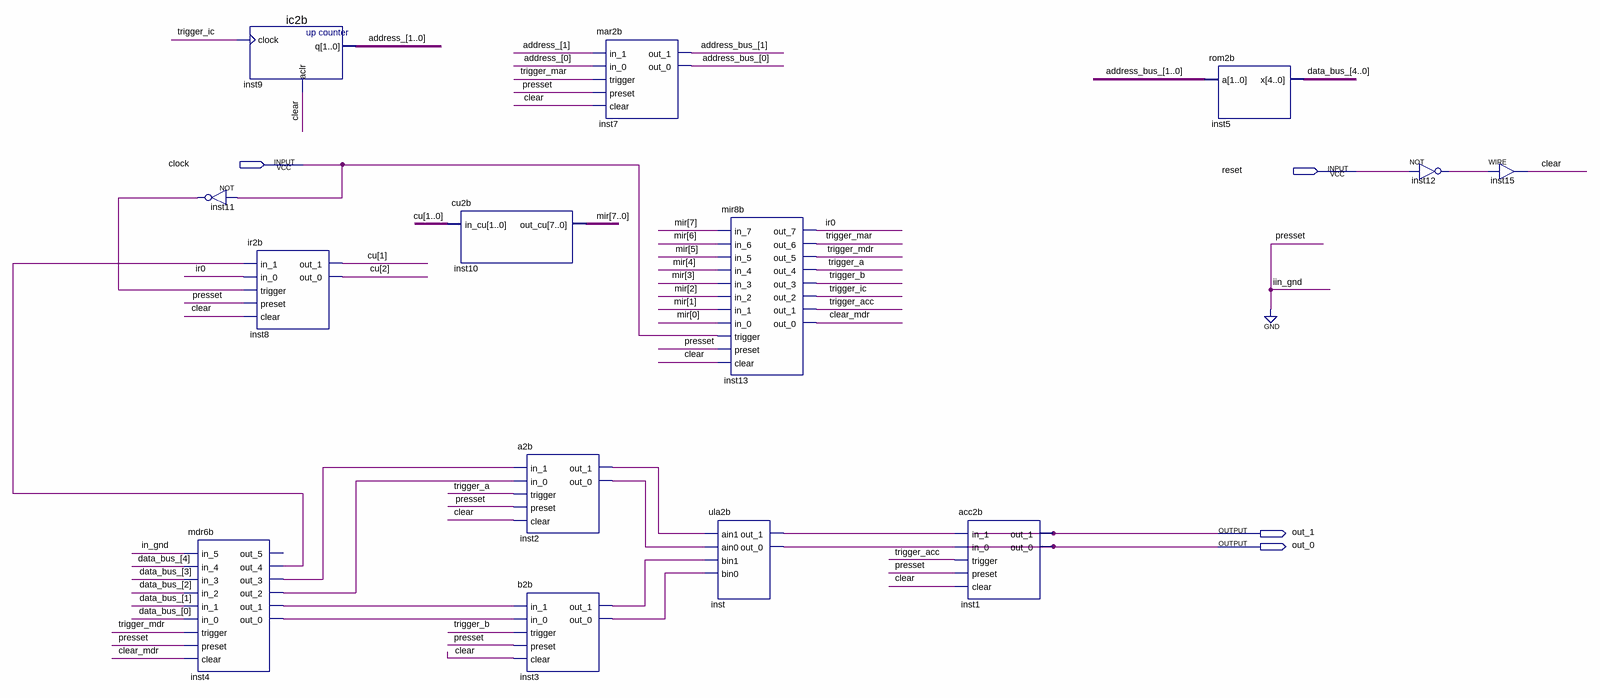
[diagram p0: schematic sheet]
// Quartus schematic FCTarc02.bdf as structural Verilog: 14 symbols, 4 pins
module FCTarc02 (
  input  clock,
  input  reset,
  output out_1,
  output out_0
);

  wire clear, clear_mdr, in_gnd, inst2_out_0, inst2_out_1, inst3_out_0, inst3_out_1, inst4_out_0,
       inst4_out_1, inst4_out_2, inst4_out_3, inst4_out_4, inst11_out, inst12_out, inst_out_0, inst_out_1,
       ir0, trigger_a, trigger_acc, trigger_b, trigger_ic, trigger_mar, trigger_mdr;
  wire [1:0] address_, address_bus_;
  wire [2:0] cu;
  wire [4:0] data_bus_;
  wire [7:0] mir;

  not inst11 (inst11_out, clock);
  mdr6b inst4 (
    .in_5(in_gnd), .in_4(data_bus_[4]), .in_3(data_bus_[3]), .in_2(data_bus_[2]), .in_1(data_bus_[1]),
    .in_0(data_bus_[0]), .trigger(trigger_mdr), .preset(1'b0), .clear(clear_mdr), .out_4(inst4_out_4),
    .out_3(inst4_out_3), .out_2(inst4_out_2), .out_1(inst4_out_1), .out_0(inst4_out_0));  // open: out_5
  ic2b inst9 (.clock(trigger_ic), .aclr(clear), .q(address_));
  ir2b inst8 (
    .in_1(inst4_out_4), .in_0(ir0), .trigger(inst11_out), .preset(1'b0), .clear(clear), .out_1(cu[1]),
    .out_0(cu[2]));
  cu2b inst10 (.in_cu(cu[1:0]), .out_cu(mir));
  a2b inst2 (
    .in_1(inst4_out_3), .in_0(inst4_out_2), .trigger(trigger_a), .preset(1'b0), .clear(clear),
    .out_1(inst2_out_1), .out_0(inst2_out_0));
  b2b inst3 (
    .in_1(inst4_out_1), .in_0(inst4_out_0), .trigger(trigger_b), .preset(1'b0), .clear(clear),
    .out_1(inst3_out_1), .out_0(inst3_out_0));
  mar2b inst7 (
    .in_1(address_[1]), .in_0(address_[0]), .trigger(trigger_mar), .preset(1'b0), .clear(clear),
    .out_1(address_bus_[1]), .out_0(address_bus_[0]));
  mir8b inst13 (
    .in_7(mir[7]), .in_6(mir[6]), .in_5(mir[5]), .in_4(mir[4]), .in_3(mir[3]), .in_2(mir[2]), .in_1(mir[1]),
    .in_0(mir[0]), .trigger(clock), .preset(1'b0), .clear(clear), .out_7(ir0), .out_6(trigger_mar),
    .out_5(trigger_mdr), .out_4(trigger_a), .out_3(trigger_b), .out_2(trigger_ic), .out_1(trigger_acc),
    .out_0(clear_mdr));
  ula2b inst (
    .ain1(inst2_out_1), .ain0(inst2_out_0), .bin1(inst3_out_1), .bin0(inst3_out_0), .out_1(inst_out_1),
    .out_0(inst_out_0));
  acc2b inst1 (
    .in_1(inst_out_1), .in_0(inst_out_0), .trigger(trigger_acc), .preset(1'b0), .clear(clear), .out_1(out_1),
    .out_0(out_0));
  rom2b inst5 (.a(address_bus_), .x(data_bus_));
  not inst12 (inst12_out, reset);
  assign clear = inst12_out;  // WIRE inst15
endmodule
